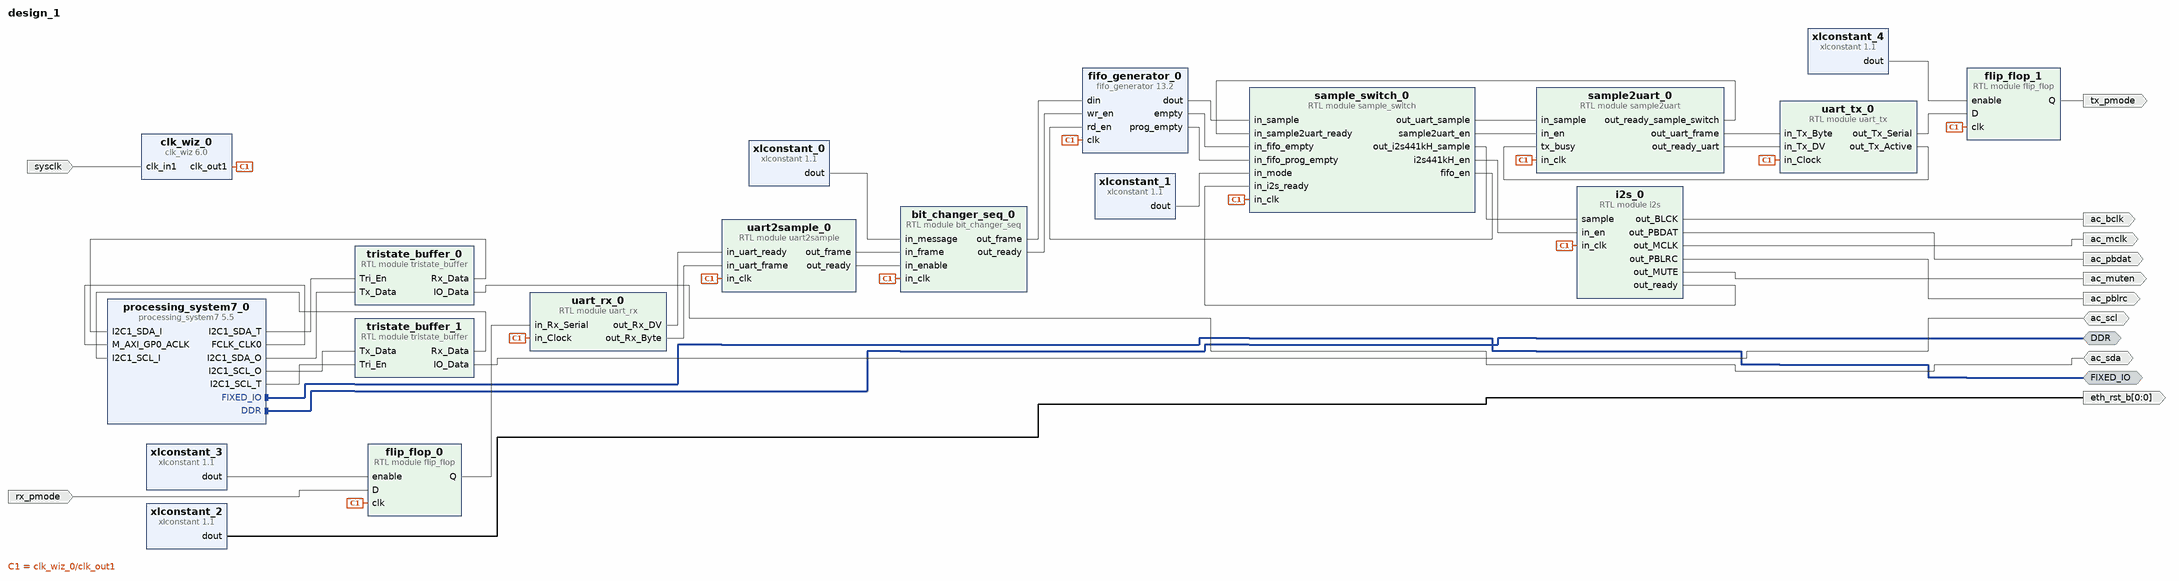
[diagram p0: block diagram of the top level]
# Vivado block design design_1, xc7z010clg400-1, Vivado 2019.2
create_bd_design design_1

create_bd_intf_port -mode Master -vlnv xilinx.com:interface:ddrx_rtl:1.0 DDR
create_bd_intf_port -mode Master -vlnv xilinx.com:display_processing_system7:fixedio_rtl:1.0 FIXED_IO
create_bd_port -dir O -from 0 -to 0 eth_rst_b
create_bd_port -dir I -type clk sysclk
set_property -dict {CONFIG.FREQ_HZ 125000000} [get_bd_ports sysclk]
create_bd_port -dir I -type data rx_pmode
create_bd_port -dir O -type data tx_pmode
create_bd_port -dir O ac_bclk
create_bd_port -dir O ac_mclk
create_bd_port -dir O ac_muten
create_bd_port -dir O ac_pbdat
create_bd_port -dir O ac_pblrc
create_bd_port -dir IO -type data ac_sda
create_bd_port -dir IO ac_scl

create_bd_cell -type ip -vlnv xilinx.com:ip:clk_wiz:6.0 clk_wiz_0
set_property -dict [list \
  CONFIG.CLKIN1_JITTER_PS 80.0 \
  CONFIG.CLKOUT1_DRIVES BUFG \
  CONFIG.CLKOUT1_JITTER 289.367 \
  CONFIG.CLKOUT1_PHASE_ERROR 351.367 \
  CONFIG.CLKOUT1_REQUESTED_OUT_FREQ 73.728 \
  CONFIG.CLKOUT2_DRIVES BUFG \
  CONFIG.CLKOUT3_DRIVES BUFG \
  CONFIG.CLKOUT4_DRIVES BUFG \
  CONFIG.CLKOUT5_DRIVES BUFG \
  CONFIG.CLKOUT6_DRIVES BUFG \
  CONFIG.CLKOUT7_DRIVES BUFG \
  CONFIG.FEEDBACK_SOURCE FDBK_AUTO \
  CONFIG.JITTER_SEL No_Jitter \
  CONFIG.MMCM_BANDWIDTH OPTIMIZED \
  CONFIG.MMCM_CLKFBOUT_MULT_F 52.125 \
  CONFIG.MMCM_CLKIN1_PERIOD 8.000 \
  CONFIG.MMCM_CLKIN2_PERIOD 10.000 \
  CONFIG.MMCM_CLKOUT0_DIVIDE_F 12.625 \
  CONFIG.MMCM_CLKOUT0_DUTY_CYCLE 0.500 \
  CONFIG.MMCM_DIVCLK_DIVIDE 7 \
  CONFIG.PRIM_IN_FREQ 125 \
  CONFIG.RESET_PORT resetn \
  CONFIG.RESET_TYPE ACTIVE_LOW \
  CONFIG.USE_LOCKED false \
  CONFIG.USE_MIN_POWER false \
  CONFIG.USE_RESET false \
  CONFIG.USE_SAFE_CLOCK_STARTUP false \
] [get_bd_cells clk_wiz_0]
create_bd_cell -type ip -vlnv xilinx.com:ip:fifo_generator:13.2 fifo_generator_0
set_property -dict [list \
  CONFIG.Empty_Threshold_Assert_Value 2 \
  CONFIG.Input_Data_Width 16 \
  CONFIG.Input_Depth 512 \
  CONFIG.Output_Data_Width 16 \
  CONFIG.Programmable_Empty_Type Single_Programmable_Empty_Threshold_Constant \
  CONFIG.Reset_Pin false \
] [get_bd_cells fifo_generator_0]
create_bd_cell -type ip -vlnv xilinx.com:ip:xlconstant:1.1 xlconstant_0
set_property -dict {CONFIG.CONST_VAL 91195452899772103062802502 CONFIG.CONST_WIDTH 88} [get_bd_cells xlconstant_0]
create_bd_cell -type ip -vlnv xilinx.com:ip:xlconstant:1.1 xlconstant_1
set_property -dict {CONFIG.CONST_VAL 1 CONFIG.CONST_WIDTH 2} [get_bd_cells xlconstant_1]
create_bd_cell -type ip -vlnv xilinx.com:ip:xlconstant:1.1 xlconstant_2
set_property -dict {CONFIG.CONST_VAL 1} [get_bd_cells xlconstant_2]
create_bd_cell -type ip -vlnv xilinx.com:ip:processing_system7:5.5 processing_system7_0
set_property -dict [list \
  CONFIG.PCW_I2C1_I2C1_IO EMIO \
  CONFIG.PCW_I2C1_PERIPHERAL_ENABLE 1 \
  CONFIG.PCW_I2C_PERIPHERAL_FREQMHZ 111.111115 \
] [get_bd_cells processing_system7_0]
# 3 more settings of processing_system7_0 are not shown: defaults, MIO pin electricals, DDR timing, and values the tool derives
create_bd_cell -type module -reference uart2sample uart2sample_0
create_bd_cell -type module -reference sample2uart sample2uart_0
create_bd_cell -type module -reference bit_changer_seq bit_changer_seq_0
create_bd_cell -type module -reference sample_switch sample_switch_0
create_bd_cell -type module -reference i2s i2s_0
create_bd_cell -type ip -vlnv xilinx.com:ip:xlconstant:1.1 xlconstant_3
create_bd_cell -type module -reference flip_flop flip_flop_0
create_bd_cell -type module -reference flip_flop flip_flop_1
create_bd_cell -type ip -vlnv xilinx.com:ip:xlconstant:1.1 xlconstant_4
create_bd_cell -type module -reference uart_rx uart_rx_0
create_bd_cell -type module -reference uart_tx uart_tx_0
create_bd_cell -type module -reference tristate_buffer tristate_buffer_0
create_bd_cell -type module -reference tristate_buffer tristate_buffer_1

# ---- connections ----

connect_bd_intf_net [get_bd_intf_ports FIXED_IO] [get_bd_intf_pins processing_system7_0/FIXED_IO]
connect_bd_intf_net [get_bd_intf_ports DDR] [get_bd_intf_pins processing_system7_0/DDR]
connect_bd_net [get_bd_pins clk_wiz_0/clk_out1] \
  [get_bd_pins fifo_generator_0/clk] [get_bd_pins uart2sample_0/in_clk] [get_bd_pins sample2uart_0/in_clk] \
  [get_bd_pins bit_changer_seq_0/in_clk] [get_bd_pins sample_switch_0/in_clk] [get_bd_pins i2s_0/in_clk] \
  [get_bd_pins flip_flop_0/clk] [get_bd_pins flip_flop_1/clk] [get_bd_pins uart_rx_0/in_Clock] \
  [get_bd_pins uart_tx_0/in_Clock]
connect_bd_net [get_bd_pins uart_rx_0/out_Rx_DV] [get_bd_pins uart2sample_0/in_uart_ready]
connect_bd_net [get_bd_pins uart_rx_0/out_Rx_Byte] [get_bd_pins uart2sample_0/in_uart_frame]
connect_bd_net [get_bd_pins uart2sample_0/out_frame] [get_bd_pins bit_changer_seq_0/in_frame]
connect_bd_net [get_bd_pins uart2sample_0/out_ready] [get_bd_pins bit_changer_seq_0/in_enable]
connect_bd_net [get_bd_pins xlconstant_0/dout] [get_bd_pins bit_changer_seq_0/in_message]
connect_bd_net [get_bd_pins bit_changer_seq_0/out_frame] [get_bd_pins fifo_generator_0/din]
connect_bd_net [get_bd_pins bit_changer_seq_0/out_ready] [get_bd_pins fifo_generator_0/wr_en]
connect_bd_net [get_bd_pins sample_switch_0/fifo_en] [get_bd_pins fifo_generator_0/rd_en]
connect_bd_net [get_bd_pins fifo_generator_0/dout] [get_bd_pins sample_switch_0/in_sample]
connect_bd_net [get_bd_pins fifo_generator_0/empty] [get_bd_pins sample_switch_0/in_fifo_empty]
connect_bd_net [get_bd_pins fifo_generator_0/prog_empty] [get_bd_pins sample_switch_0/in_fifo_prog_empty]
connect_bd_net [get_bd_pins xlconstant_1/dout] [get_bd_pins sample_switch_0/in_mode]
connect_bd_net [get_bd_pins sample2uart_0/out_ready_sample_switch] [get_bd_pins sample_switch_0/in_sample2uart_ready]
connect_bd_net [get_bd_pins i2s_0/out_ready] [get_bd_pins sample_switch_0/in_i2s_ready]
connect_bd_net [get_bd_pins sample_switch_0/out_uart_sample] [get_bd_pins sample2uart_0/in_sample]
connect_bd_net [get_bd_pins sample_switch_0/out_i2s441kH_sample] [get_bd_pins i2s_0/sample]
connect_bd_net [get_bd_pins sample_switch_0/sample2uart_en] [get_bd_pins sample2uart_0/in_en]
connect_bd_net [get_bd_pins sample_switch_0/i2s441kH_en] [get_bd_pins i2s_0/in_en]
connect_bd_net [get_bd_pins uart_tx_0/out_Tx_Active] [get_bd_pins sample2uart_0/tx_busy]
connect_bd_net [get_bd_pins sample2uart_0/out_uart_frame] [get_bd_pins uart_tx_0/in_Tx_Byte]
connect_bd_net [get_bd_pins sample2uart_0/out_ready_uart] [get_bd_pins uart_tx_0/in_Tx_DV]
connect_bd_net [get_bd_pins xlconstant_2/dout] [get_bd_ports eth_rst_b]
connect_bd_net [get_bd_pins processing_system7_0/FCLK_CLK0] [get_bd_pins processing_system7_0/M_AXI_GP0_ACLK]
connect_bd_net [get_bd_ports sysclk] [get_bd_pins clk_wiz_0/clk_in1]
connect_bd_net [get_bd_pins i2s_0/out_BLCK] [get_bd_ports ac_bclk]
connect_bd_net [get_bd_pins i2s_0/out_PBDAT] [get_bd_ports ac_pbdat]
connect_bd_net [get_bd_pins i2s_0/out_PBLRC] [get_bd_ports ac_pblrc]
connect_bd_net [get_bd_pins i2s_0/out_MUTE] [get_bd_ports ac_muten]
connect_bd_net [get_bd_pins i2s_0/out_MCLK] [get_bd_ports ac_mclk]
connect_bd_net [get_bd_pins xlconstant_3/dout] [get_bd_pins flip_flop_0/enable]
connect_bd_net [get_bd_ports rx_pmode] [get_bd_pins flip_flop_0/D]
connect_bd_net -net flip_flop_0_out [get_bd_pins flip_flop_0/Q] [get_bd_pins uart_rx_0/in_Rx_Serial]
connect_bd_net [get_bd_pins uart_tx_0/out_Tx_Serial] [get_bd_pins flip_flop_1/D]
connect_bd_net [get_bd_pins flip_flop_1/Q] [get_bd_ports tx_pmode]
connect_bd_net [get_bd_pins xlconstant_4/dout] [get_bd_pins flip_flop_1/enable]
connect_bd_net [get_bd_pins processing_system7_0/I2C1_SDA_T] [get_bd_pins tristate_buffer_0/Tri_En]
connect_bd_net [get_bd_pins processing_system7_0/I2C1_SDA_O] [get_bd_pins tristate_buffer_0/Tx_Data]
connect_bd_net [get_bd_pins tristate_buffer_0/Rx_Data] [get_bd_pins processing_system7_0/I2C1_SDA_I]
connect_bd_net [get_bd_ports ac_sda] [get_bd_pins tristate_buffer_0/IO_Data]
connect_bd_net [get_bd_pins tristate_buffer_1/Rx_Data] [get_bd_pins processing_system7_0/I2C1_SCL_I]
connect_bd_net [get_bd_pins processing_system7_0/I2C1_SCL_O] [get_bd_pins tristate_buffer_1/Tx_Data]
connect_bd_net [get_bd_pins processing_system7_0/I2C1_SCL_T] [get_bd_pins tristate_buffer_1/Tri_En]
connect_bd_net [get_bd_ports ac_scl] [get_bd_pins tristate_buffer_1/IO_Data]

validate_bd_design
save_bd_design
